# EAGLE design AIS_Mk2 (EAGLE 5.10)
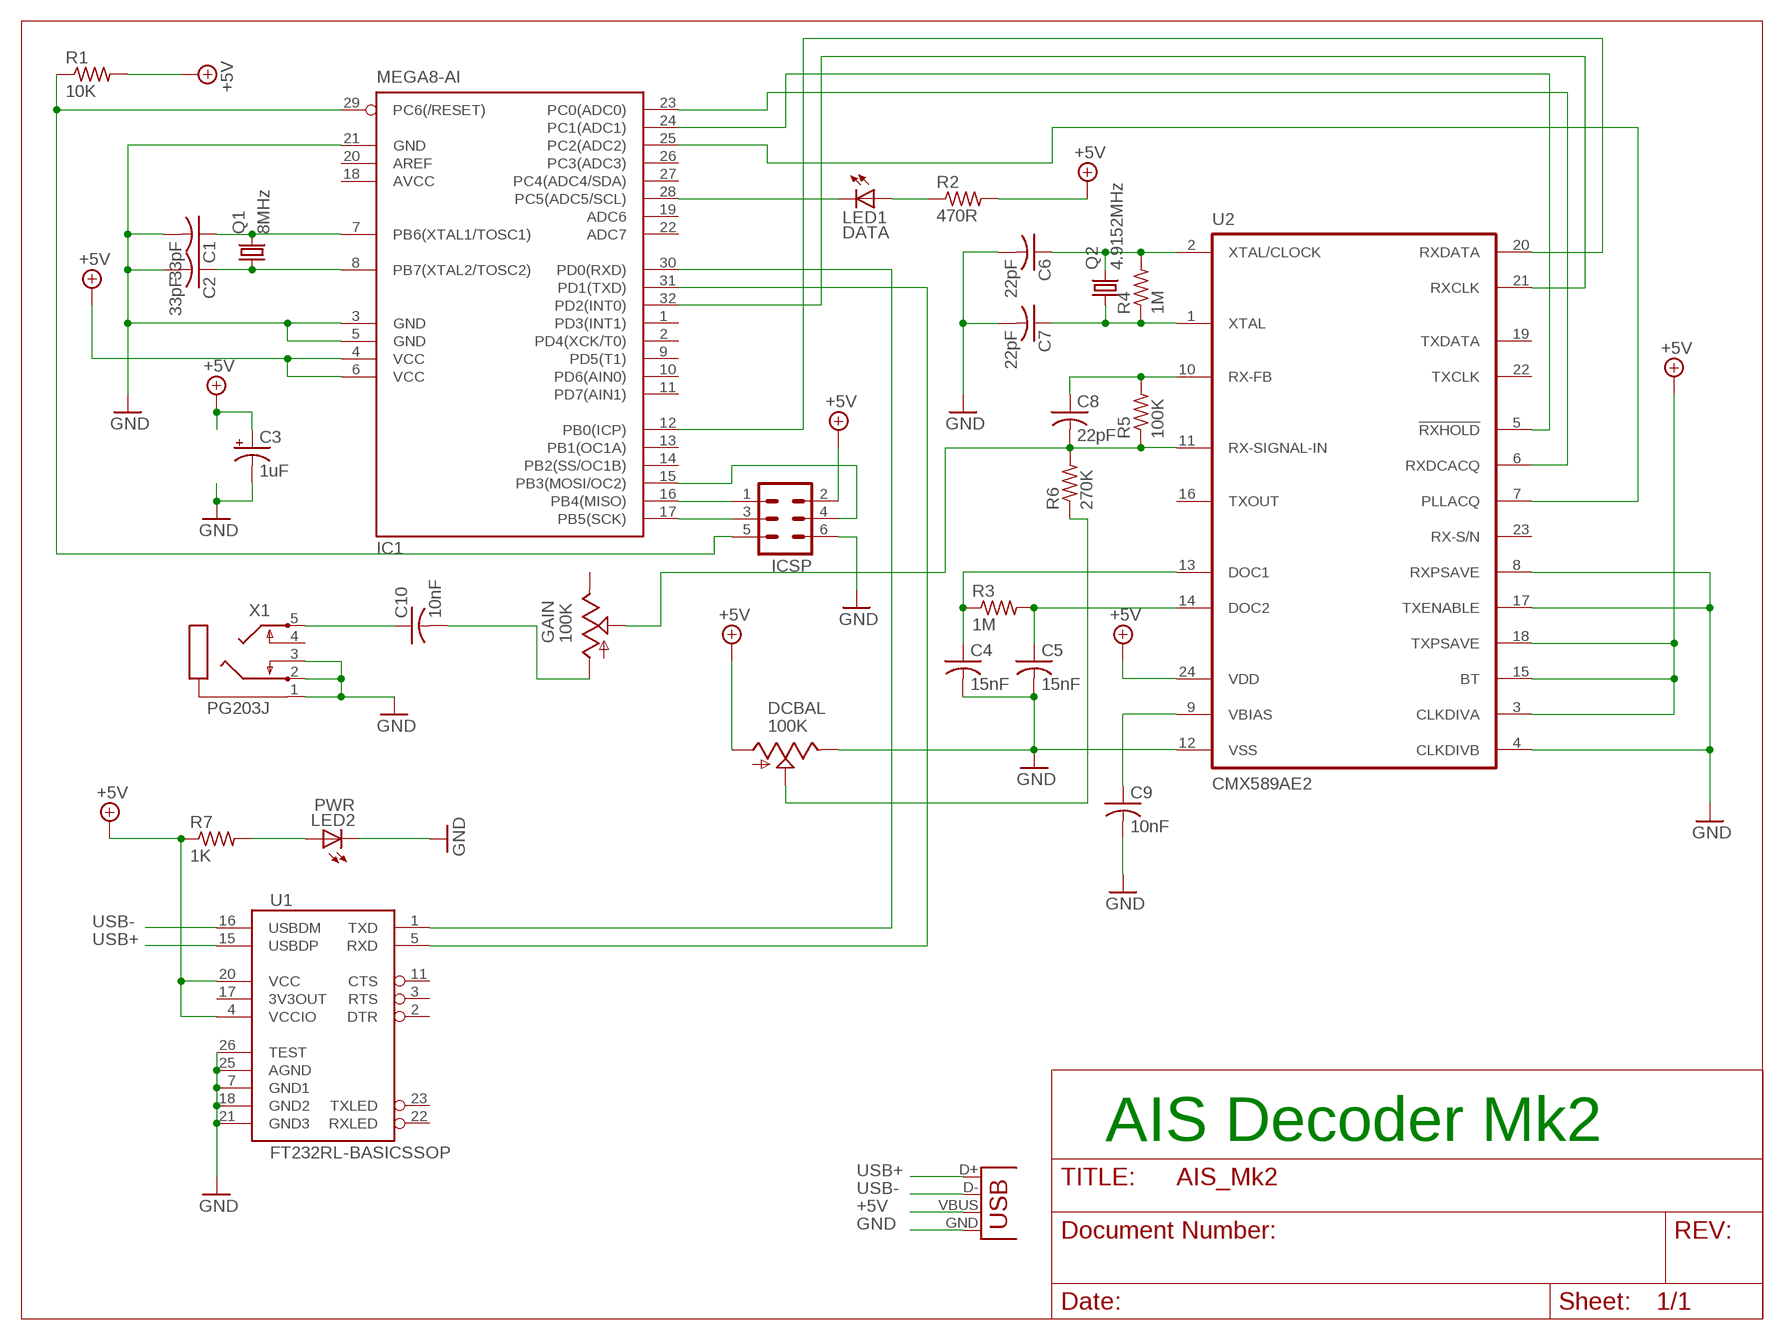
[diagram p0: schematic, sheet 1]

## Parts
C1  33pF  C-USC0805  [C0805]
C2  33pF  C-USC0805  [C0805]
C3  1uF  CPOL-USE2,5-6E  [E2,5-6E]
C4  15nF  C-USC0805  [C0805]
C5  15nF  C-USC0805  [C0805]
C6  22pF  C-USC0805  [C0805]
C7  22pF  C-USC0805  [C0805]
C8  22pF  C-USC0805  [C0805]
C9  10nF  C-USC0805  [C0805]
C10  10nF  C-USC0805  [C0805]
DCBAL  100K  TRIM_US-CA6V  [CA6V]
GAIN  100K  TRIM_US-CA6V  [CA6V]
IC1  MEGA8-AI  [TQFP32-08]
ICSP  MA03-2  [MA03-2]
LED1  DATA  LEDCHIP-LED0805  [CHIP-LED0805]
LED2  PWR  LEDCHIP-LED0805  [CHIP-LED0805]
Q1  8MHz  CRYSTALHC49S  [HC49/S]
Q2  4.9152MHz  CRYSTALHC49S  [HC49/S]
R1  10K  R-US_M0805  [M0805]
R2  470R  R-US_M0805  [M0805]
R3  1M  R-US_M0805  [M0805]
R4  1M  R-US_M0805  [M0805]
R5  100K  R-US_M0805  [M0805]
R6  270K  R-US_M0805  [M0805]
R7  1K  R-US_M0805  [M0805]
U1  FT232RL-BASICSSOP  [SSOP28DB]
U2  CMX589AE2  [TSSOP24]
X1  PG203J  [PG203J]
X2  USBSMD  [USB-MINIB]

## Nets
+5V: C3.+ DCBAL.A IC1.4(VCC) IC1.6(VCC) ICSP.2 R1.2 R2.2 R7.1 U1.4(VCCIO) U1.20(VCC) U2.3(CLKDIVA) U2.15(BT) U2.18(TXPSAVE) U2.24(VDD) X2.VBUS
DCBAL: DCBAL.S R6.1
GND: C1.2 C2.2 C3.- C4.2 C5.2 C6.2 C7.2 C9.2 DCBAL.E IC1.3(GND) IC1.5(GND) IC1.21(GND) ICSP.6 LED2.C U1.7(GND1) U1.18(GND2) U1.21(GND3) U1.25(AGND) U1.26(TEST) U2.4(CLKDIVB) U2.8(RXPSAVE) U2.12(VSS) U2.17(TXENABLE) X1.1 X1.2 X1.3 X2.GND
N$1: C2.1 IC1.8(PB7(XTAL2/TOSC2)) Q1.1
N$2: C1.1 IC1.7(PB6(XTAL1/TOSC1)) Q1.2
N$3: IC1.16(PB4(MISO)) ICSP.1
N$4: IC1.17(PB5(SCK)) ICSP.3
N$5: IC1.15(PB3(MOSI/OC2)) ICSP.4
N$6: IC1.29(PC6(/RESET)) ICSP.5 R1.1
N$7: C4.1 R3.1 U2.13(DOC1)
N$8: IC1.28(PC5(ADC5/SCL)) LED1.C
N$9: LED1.A R2.1
N$10: C5.1 R3.2 U2.14(DOC2)
N$11: IC1.30(PD0(RXD)) U1.1(TXD)
N$12: IC1.31(PD1(TXD)) U1.5(RXD)
N$13: C7.1 Q2.1 R4.1 U2.1(XTAL)
N$14: C6.1 Q2.2 R4.2 U2.2(XTAL/CLOCK)
N$15: C8.1 R5.2 U2.10(RX-FB)
N$16: C10.2 GAIN.A
N$17: C10.1 X1.5
N$18: C9.1 U2.9(VBIAS)
N$19: IC1.32(PD2(INT0)) U2.21(RXCLK)
N$20: IC1.12(PB0(ICP)) U2.20(RXDATA)
N$21: IC1.24(PC1(ADC1)) U2.5(!RXHOLD!)
N$22: IC1.23(PC0(ADC0)) U2.6(RXDCACQ)
N$23: IC1.25(PC2(ADC2)) U2.7(PLLACQ)
N$24: LED2.A R7.2
SIG: C8.2 GAIN.S R5.1 R6.2 U2.11(RX-SIGNAL-IN)
USB+: U1.15(USBDP) X2.D+
USB-: U1.16(USBDM) X2.D-
Unconnected: GAIN.E IC1.1(PD3(INT1)) IC1.2(PD4(XCK/T0)) IC1.9(PD5(T1)) IC1.10(PD6(AIN0)) IC1.11(PD7(AIN1)) IC1.13(PB1(OC1A)) IC1.14(PB2(SS/OC1B)) IC1.19(ADC6) IC1.20(AREF) IC1.22(ADC7) IC1.26(PC3(ADC3)) IC1.27(PC4(ADC4/SDA)) U1.2(DTR) U1.3(RTS) U1.11(CTS) U1.17(3V3OUT) U1.22(RXLED) U1.23(TXLED) U2.16(TXOUT) U2.19(TXDATA) U2.22(TXCLK) U2.23(RX-S/N) X1.4

## Notes on the sheet
- AIS Decoder Mk2

## Power pins joined to a net without a drawn wire
AVCC: IC1.18(AVCC)

## Library data of the parts
C1 C2 C4-C10 = resistor:C-US: CAPACITOR, American symbol
C3 = resistor:CPOL-US: POLARIZED CAPACITOR, American symbol
DCBAL GAIN = pot:TRIM_US-: POTENTIOMETER
IC1 = atmel:MEGA8: MICROCONTROLLER 8 Kbytes FLASH, 1 kbytes SRAM, 512 bytes EEPROM, USART, 6-channel 10 bit ADC, 2-channel 8 bit ADC Pin compatible with Atmega48, ATMega88, ATMega168 Source: avr.lbr
ICSP = con-lstb:MA03-2: PIN HEADER
LED1 LED2 = led:LED: LED OSRAM: - CHIPLED LG R971, LG N971, LY N971, LG Q971, LY Q971, LO R971, LY R971 LH N974, LH R974 LS Q976, LO Q976, LY Q976 LO Q996 - Hyper CHIPLED LW Q18S LB Q993, LB Q99A, LB R99A - SideLED LS A670, LO A670, LY A670, LG A670, LP A670 LB A673, LV A673, LT A673, LW A673 LH A674 LY A675 LS A676, LA A676, LO A676, LY A676, LW A676 LS A679, LY A679, LG A679 - Hyper Micro SIDELED® LS Y876, LA Y876, LO Y876, LY Y876 LT Y87S - SmartLED LW L88C, LW L88S LB L89C, LB L89S, LG L890 LS L89K, LO L89K, LY L89K LS L896, LA L896, LO L896, LY L896 - TOPLED LS T670, LO T670, LY T670, LG T670, LP T670 LSG T670, LSP T670, LSY T670, LOP T670, LYG T670 LG T671, LOG T671, LSG T671 LB T673, LV T673, LT T673, LW T673 LH T674 LS T676, LA T676, LO T676, LY T676, LB T676, LH T676, LSB T676, LW T676 LB T67C, LV T67C, LT T67C, LS T67K, LO T67K, LY T67K, LW E67C LS E67B, LA E67B, LO E67B, LY E67B, LB E67C, LV E67C, LT E67C LW T67C LS T679, LY T679, LG T679 LS T770, LO T770, LY T770, LG T770, LP T770 LB T773, LV T773, LT T773, LW T773 LH T774 LS E675, LA E675, LY E675, LS T675 LS T776, LA T776, LO T776, LY T776, LB T776 LHGB T686 LT T68C, LB T68C - Hyper Mini TOPLED® LB M676 - Mini TOPLED Santana® LG M470 LS M47K, LO M47K, LY M47K Source: http://www.osram.convergy.de LUXEON: - LUMILED® LXK2-PW12-R00, LXK2-PW12-S00, LXK2-PW14-U00, LXK2-PW14-V00 LXK2-PM12-R00, LXK2-PM12-S00, LXK2-PM14-U00 LXK2-PE12-Q00, LXK2-PE12-R00, LXK2-PE12-S00, LXK2-PE14-T00, LXK2-PE14-U00 LXK2-PB12-K00, LXK2-PB12-L00, LXK2-PB12-M00, LXK2-PB14-N00, LXK2-PB14-P00, LXK2-PB14-Q00 LXK2-PR12-L00, LXK2-PR12-M00, LXK2-PR14-Q00, LXK2-PR14-R00 LXK2-PD12-Q00, LXK2-PD12-R00, LXK2-PD12-S00 LXK2-PH12-R00, LXK2-PH12-S00 LXK2-PL12-P00, LXK2-PL12-Q00, LXK2-PL12-R00 Source: www.luxeon.com KINGBRIGHT: KA-3528ASYC Source: www.kingbright.com
Q1 Q2 = crystal:CRYSTAL: CRYSTAL
R1-R7 = resistor:R-US_: RESISTOR, American symbol
U1 = SparkFun:FT232RL-BASIC: USB UART This is the simplified version of the FT232RL unit. Only what you need, nothing you don't. Spark Fun Electronics SKU : COM-00650
U2 = cml-micro:CMX589A: HIGH-SPEED GMSK MODEM
X1 = con-hirschmann:PG203J: MIC/HEADPHONE JACK KS-S stereo microphone/headphone jack PG203JN (Schukat)
X2 = SparkFun:USB: USB Connectors USB-B-PTH is fully proven SKU : PRT-00139 USB-miniB is fully proven SKU : PRT-00587 USB-A-PCB is untested. USB-A-H is throughly reviewed, but untested. Spark Fun Electronics SKU : PRT-00437 USB-B-SMT is throughly reviewed, but untested. Needs silkscreen touching up. USB-A-S has not been used/tested USB-MB-H has not been used/tested

## Board
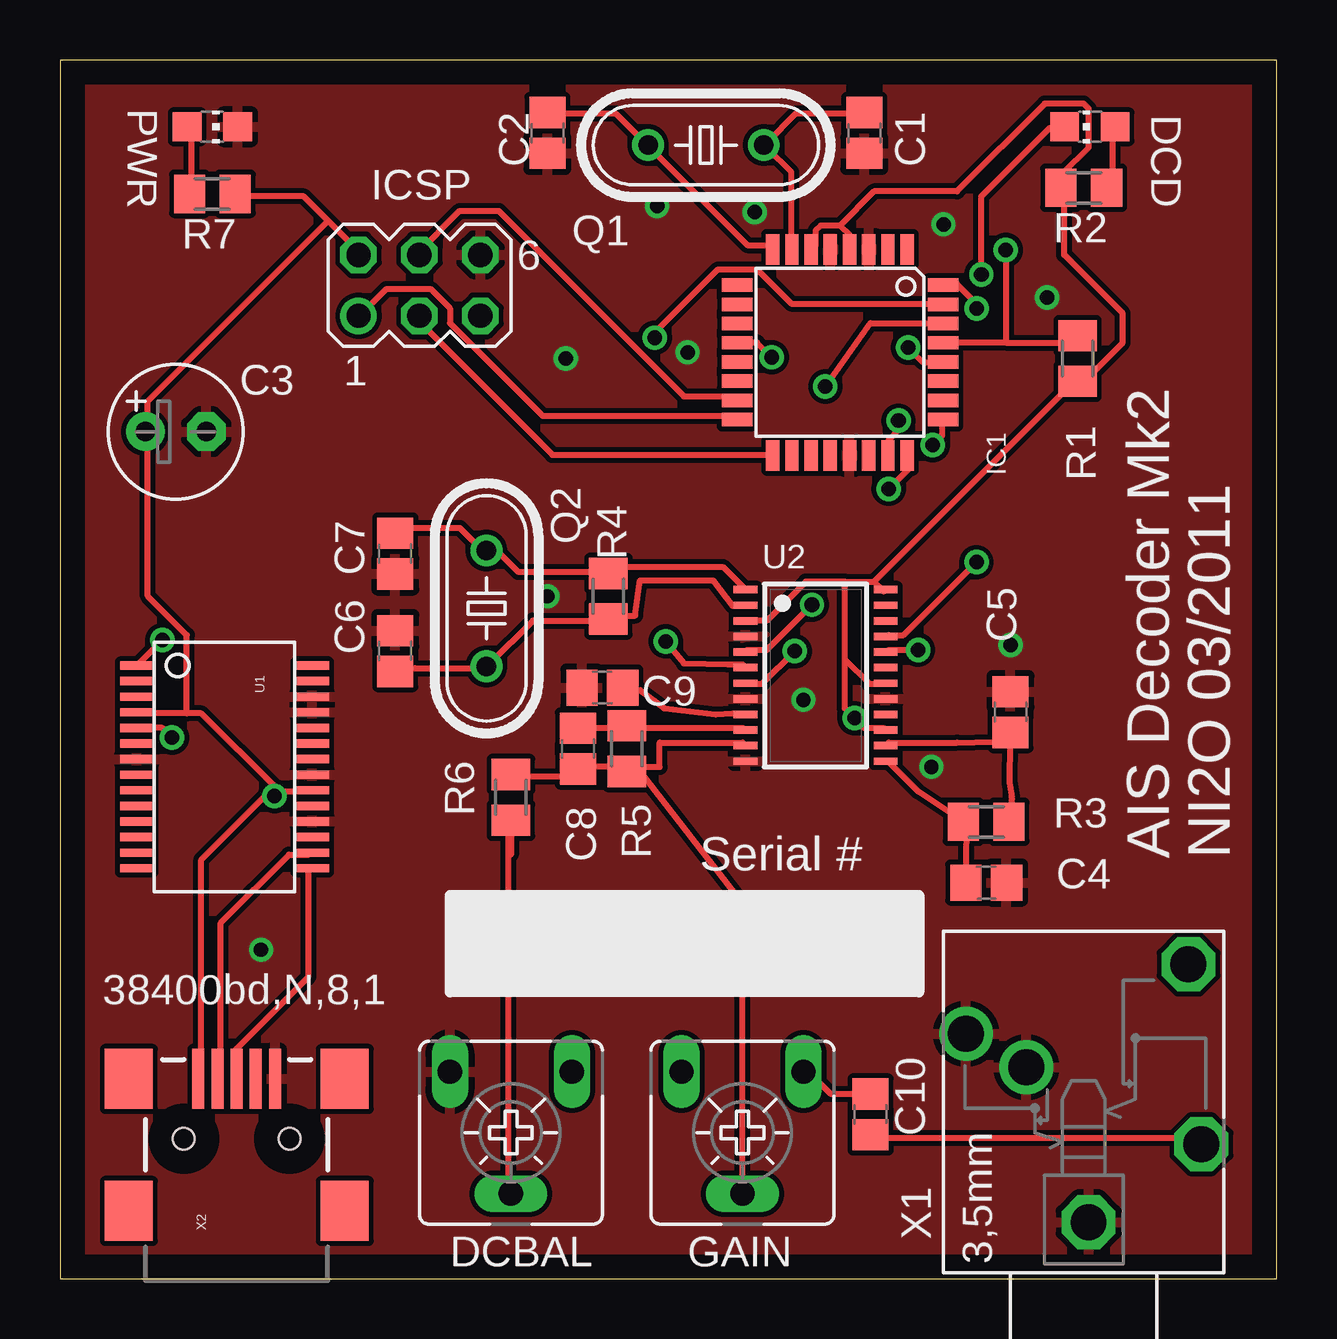
[diagram p1: board, top side]
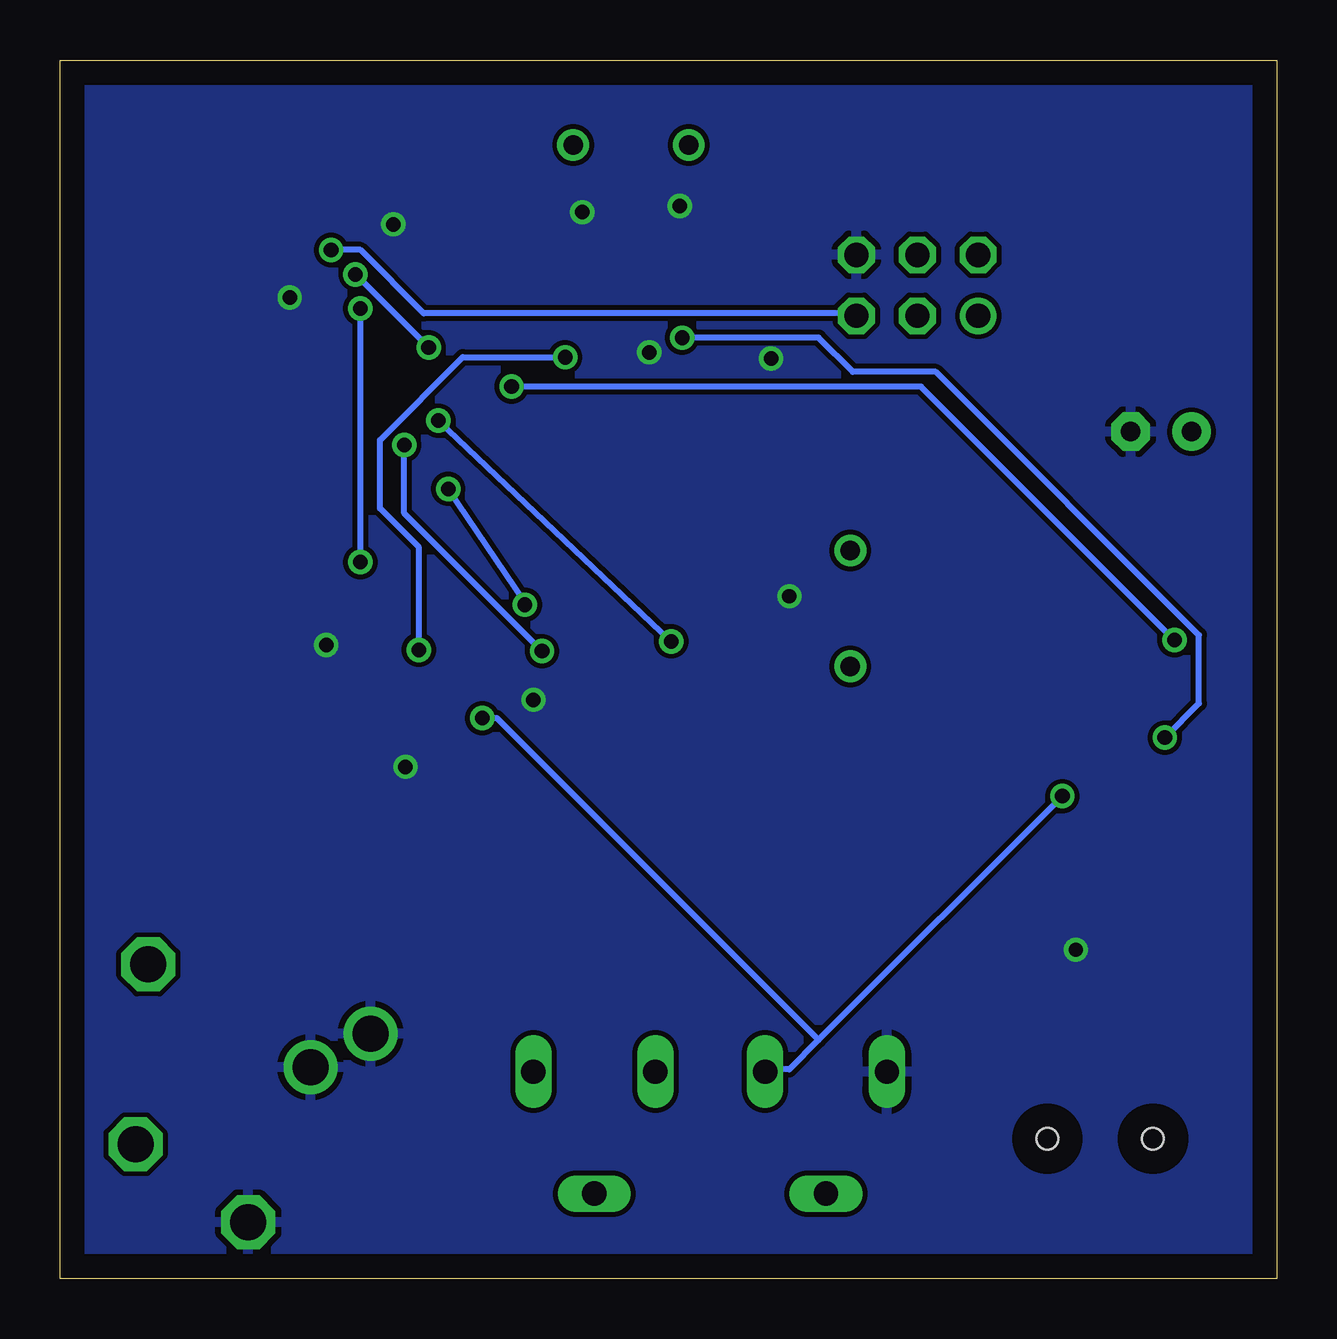
[diagram p2: board, bottom side, seen from below]

Size 50.72 x 50.79 mm. Coordinates in mm from the lower left corner, seen from the top.
Outline: 0,0 50.72,0 50.72,50.79 0,50.79 0,0
Copper layers (1*16): Top 0.035mm / dielectric 1.5mm / Bottom 0.035mm
Design rules "default": minimum track width 10mil, minimum drill 24mil, track to track 8mil, track to pad 8mil, pad to pad 8mil, via to via 8mil, smd to smd 8mil, copper to edge 40mil, drill to drill 8mil, minimum pad ring 10mil, minimum via ring 8mil, stop-mask expansion 4mil, vias tented up to drill 0mil, thermal gap 10mil

### Footprints (pad centres in the part's own frame; a part is rotated, then mirrored left to right if it is on the bottom)
C0805 = smd 1.3 x 1.5: 1 -0.85,0; 2 0.85,0
E2,5-6 = drill 0.813 pad 1.6 round: + -1.27,0 | drill 0.813 pad 1.6 octagon: - 1.27,0
CA6V = drill 1.016 long: A -2.54,-2.54; E 2.54,-2.54; S 0,2.54
TQFP32-08 = smd 1.27 x 0.559: 1 -4.293,2.8; 2 -4.293,2; 3 -4.293,1.2; 4 -4.293,0.4; 5 -4.293,-0.4; 6 -4.293,-1.2; 7 -4.293,-2; 8 -4.293,-2.8; 17 4.293,-2.8; 18 4.293,-2; 19 4.293,-1.2; 20 4.293,-0.4; 21 4.293,0.4; 22 4.293,1.2; 23 4.293,2; 24 4.293,2.8 | smd 0.559 x 1.27: 9 -2.8,-4.293; 10 -2,-4.293; 11 -1.2,-4.293; 12 -0.4,-4.293; 13 0.4,-4.293; 14 1.2,-4.293; 15 2,-4.293; 16 2.8,-4.293; 25 2.8,4.293; 26 2,4.293; 27 1.2,4.293; 28 0.4,4.293; 29 -0.4,4.293; 30 -1.2,4.293; 31 -2,4.293; 32 -2.8,4.293
MA03-2 = drill 1.016 round: 1 -2.54,-1.27 | drill 1.016 octagon: 2 -2.54,1.27; 3 0,-1.27; 4 0,1.27; 5 2.54,-1.27; 6 2.54,1.27
CHIP-LED0805 = smd 1.2 x 1.2: A 0,-1.05; C 0,1.05
HC49/S = drill 0.813 round: 1 -2.413,0; 2 2.413,0
M0805 = smd 1.3 x 1.6: 1 -0.95,0; 2 0.95,0
SSOP28DB = smd 0.348 x 1.397: 1 -4.225,-3.656; 2 -3.575,-3.656; 3 -2.925,-3.656; 4 -2.275,-3.656; 5 -1.625,-3.656; 6 -0.975,-3.656; 7 -0.325,-3.656; 8 0.325,-3.656; 9 0.975,-3.656; 10 1.625,-3.656; 11 2.275,-3.656; 12 2.925,-3.656; 13 3.575,-3.656; 14 4.225,-3.656; 15 4.225,3.656; 16 3.575,3.656; 17 2.925,3.656; 18 2.275,3.656; 19 1.625,3.656; 20 0.975,3.656; 21 0.325,3.656; 22 -0.325,3.656; 23 -0.975,3.656; 24 -1.625,3.656; 25 -2.275,3.656; 26 -2.925,3.656; 27 -3.575,3.656; 28 -4.225,3.656
TSSOP24 = smd 0.305 x 0.991: 1 -3.575,-2.918; 2 -2.925,-2.918; 3 -2.275,-2.918; 4 -1.625,-2.918; 5 -0.975,-2.918; 6 -0.325,-2.918; 7 0.325,-2.918; 8 0.975,-2.918; 9 1.625,-2.918; 10 2.275,-2.918; 11 2.925,-2.918; 12 3.575,-2.918; 13 3.575,2.918; 14 2.925,2.918; 15 2.275,2.918; 16 1.625,2.918; 17 0.975,2.918; 18 0.325,2.918; 19 -0.325,2.918; 20 -0.975,2.918; 21 -1.625,2.918; 22 -2.275,2.918; 23 -2.925,2.918; 24 -3.575,2.918
PG203J = drill 1.499 octagon: 1 -5.004,-0.203; 4 5.74,-4.369; 5 -1.753,-4.902 | drill 1.499 round: 2 2.845,4.902; 3 1.448,2.388
USB-MINIB = smd 2.5 x 0.5: D+ 2.5,0; D- 2.5,0.8; GND 2.5,-1.6; ID 2.5,-0.8; VBUS 2.5,1.6 | smd 2.5 x 2: GND@1 -3,-4.5; GND@2 -3,4.5; GND@3 2.5,4.5; GND@4 2.5,-4.5 | hole 0.9: 0,2.2; 0,-2.2

### Placement (x,y rotation side)
C1  33.53,47.75 270 top
C2  20.32,47.75 270 top
C3  1uF  [E2,5-6]  4.83,35.31 0 top
C4  38.61,16.51 0 top
C5  39.62,23.62 90 top
C6  13.97,26.16 90 top
C7  13.97,30.23 270 top
C8  21.59,22.1 270 top
C9  22.61,24.64 180 top
C10  33.78,6.86 90 top
DCBAL  18.8,6.1 180 top
GAIN  28.45,6.1 180 top
IC1  32.51,38.61 270 top
ICSP  14.99,41.4 0 top
LED1  42.93,48.01 90 top
LED2  6.35,48.01 270 top
Q1  26.92,47.24 0 top
Q2  17.78,27.94 270 top
R1  42.42,38.35 270 top
R2  42.67,45.47 180 top
R3  38.61,19.05 0 top
R4  22.86,28.45 270 top
R5  23.62,22.1 90 top
R6  18.8,20.07 90 top
R7  6.35,45.21 180 top
U1  6.86,21.34 270 top
U2  31.5,25.15 270 top
X1  42.67,7.37 90 top
X2  7.37,5.84 90 top

### Tracks (layer width: path | path; a pad name or v marks a point on that pad's centre or on a via)
+5V  (via drill 0.61)
  Top 0.254: 32.51,43.89 31.7,43.89 31.5,43.69 31.5,43.08 IC1.6 | 32.51,43.89 32.92,43.48 32.92,43.08 IC1.4 | 32.72,29.06 33.93,29.06 | 32.72,29.06 31.09,29.06 29.46,27.43 28.65,27.43 U2.3 | 33.93,29.06 34.34,28.65 U2.24 | 32.72,25.81 32.72,29.06 | 32.72,25.81 32.72,23.77 v33.12,23.37 33.53,22.96 34.34,22.96 U2.15 | 32.72,25.81 33.73,24.79 34.34,24.79 U2.18 | 33.93,29.06 42.27,37.39 R1.2 42.47,37.59 42.88,37.59 44.3,39.01 44.3,40.23 41.86,42.67 41.86,45.31 R2.2 41.86,45.52 41.86,46.13 42.88,47.14 42.88,48.77 42.67,48.97 41.05,48.97 37.39,45.31 33.93,45.31 32.51,43.89 | 11.18,44.09 12.6,42.67 ICSP.2 | 11.18,44.09 10.16,45.11 7.32,45.11 R7.1 | 11.18,44.09 3.66,36.58 3.66,35.36 C3.+ 3.66,35.15 3.66,28.45 5.28,26.82 5.28,23.57 | 5.28,23.57 5.89,23.57 8.94,20.52 | 5.28,23.57 3.25,23.57 U1.4 | 8.94,20.52 9.14,20.32 10.36,20.32 U1.20 | 8.74,20.32 8.94,20.52 | 8.74,20.32 5.89,17.48 5.89,8.53 X2.VBUS | 8.74,20.32 v8.94,20.12
  Bottom 0.254: v8.94,20.12 19.1,9.96 | 19.1,9.96 20.32,8.74 21.34,8.74 DCBAL.A | v33.12,23.37 32.51,23.37 19.1,9.96
DCBAL
  Top 0.254: 18.8,19.1 18.69,18.69 18.69,3.66 DCBAL.S | 18.8,19.1 18.8,17.68 | 18.8,19.1 R6.1
GND  (via drill 0.6)
  other vias: 21.08,38.35 26.16,38.61 41.15,40.89 20.32,28.45 8.38,13.72 36.83,43.94 30.99,24.13 36.32,21.34 39.62,26.42 24.89,44.7 28.96,44.45
  pour Bottom: 0,0 0,50.8 50.8,50.8 50.8,0
  pour Top: 0,0 0,50.8 50.8,50.8 50.8,0
N$1
  Top 0.254: C2.1 20.32,48.56 23.16,48.56 24.38,47.35 Q1.1 24.59,47.14 28.65,43.08 29.67,43.08 IC1.8
N$2
  Top 0.254: C1.1 33.53,48.56 30.68,48.56 29.46,47.35 Q1.2 29.46,47.14 30.48,46.13 30.48,43.08 IC1.7
N$3
  Top 0.254: IC1.16 28.04,35.97 20.12,35.97 16.26,39.83 16.26,40.44 15.44,41.25 13.61,41.25 12.6,40.23 ICSP.1
N$4
  Top 0.254: IC1.17 29.67,34.34 20.52,34.34 14.83,40.03 ICSP.3
N$5
  Top 0.254: IC1.15 28.04,36.78 26.01,36.78 18.29,44.5 16.66,44.5 14.83,42.67 ICSP.4
N$6  (via drill 0.61)
  Top 0.254: 39.42,39.01 42.06,39.01 42.27,39.22 R1.1 | 39.42,39.01 36.98,39.01 IC1.29 | v39.42,42.88 39.42,39.01
  Bottom 0.254: v39.42,42.88 38.2,42.88 35.56,40.23 17.68,40.23 ICSP.5
N$7
  Top 0.254: U2.13 34.54,21.54 35.76,20.32 R3.1 37.8,18.8 37.8,18.69 C4.1
N$8  (via drill 0.61)
  Top 0.254: v38.41,41.86 38.41,45.11 41.25,47.95 41.86,47.95 LED1.C | v35.36,38.81 35.97,38.2 36.78,38.2 IC1.28
  Bottom 0.254: v35.36,38.81 v38.41,41.86
N$9
  Top 0.254: LED1.A 43.89,47.95 43.89,45.72 43.69,45.52 R2.1
N$10
  Top 0.254: U2.14 34.54,22.35 37.39,22.35 39.62,22.4 C5.1 39.57,21.13 39.57,20.68 39.67,20.07 R3.2
N$11  (via drill 0.61)
  Top 0.254: v31.9,37.19 33.78,39.83 36.78,39.83 IC1.30 | v4.27,26.62 3.25,25.6 U1.1
  Bottom 0.254: v31.9,37.19 14.83,37.19 v4.27,26.62
N$12  (via drill 0.61)
  Top 0.254: v24.79,39.22 24.79,39.42 27.43,42.06 29.06,42.06 30.48,40.64 36.78,40.64 IC1.31 | v4.67,22.55 4.27,22.96 3.25,22.96 U1.5
  Bottom 0.254: v24.79,39.22 19.1,39.22 17.68,37.8 14.22,37.8 3.25,26.82 3.25,23.98 v4.67,22.55
N$13
  Top 0.254: U2.1 28.45,28.85 27.64,29.67 23.16,29.67 22.96,29.46 R4.1 22.76,29.46 19.1,29.46 18.29,30.28 17.88,30.28 Q2.1 17.68,30.28 16.66,31.29 14.02,31.29 C7.1
N$14
  Top 0.254: U2.2 28.45,28.04 28.04,28.04 27.23,29.11 24.18,29.11 23.98,27.64 22.96,27.64 R4.2 22.76,27.43 19.71,27.43 17.88,25.6 Q2.2 17.68,25.6 17.58,25.45 14.78,25.45 C6.1
N$15
  Top 0.254: U2.10 28.45,22.96 23.98,22.96 R5.2 23.77,22.96 21.95,22.96 C8.1
N$16
  Top 0.254: C10.2 33.73,7.72 32.11,7.72 31.09,8.74 GAIN.A
N$17
  Top 0.254: C10.1 33.93,5.89 47.35,5.89 47.55,5.69 X1.5
N$18
  Top 0.254: U2.9 28.45,23.57 28.04,23.57 27.33,23.52 25.2,23.77 24.18,24.54 C9.1
N$19  (via drill 0.61)
  Top 0.254: v38.2,29.87 35.15,26.82 34.54,26.82 U2.21 | v38.2,40.44 38.2,40.64 37.39,41.45 36.98,41.45 IC1.32
  Bottom 0.254: v38.2,29.87 v38.2,40.44
N$20  (via drill 0.61)
  Top 0.254: v35.76,26.21 34.54,26.21 U2.20 | v29.67,38.41 29.06,39.01 28.25,39.01 IC1.12
  Bottom 0.254: v35.76,26.21 35.76,30.48 37.39,32.11 37.39,34.95 33.93,38.41 v29.67,38.41
N$21  (via drill 0.61)
  Top 0.254: v31.34,28.09 29.46,26.21 28.65,26.21 U2.5 | v34.54,32.92 35.36,33.73 35.36,34.14 IC1.24
  Bottom 0.254: v31.34,28.09 31.34,28.19 v34.54,32.92
N$22  (via drill 0.61)
  Top 0.254: v25.25,26.57 26.01,25.65 27.84,25.6 28.45,25.6 U2.6 | v34.95,35.76 34.95,35.36 34.54,34.95 34.54,34.34 IC1.23
  Bottom 0.254: v25.25,26.57 v34.95,35.76
N$23  (via drill 0.61)
  Top 0.254: v30.63,26.16 29.26,24.79 28.65,24.79 U2.7 | v36.37,34.75 36.78,35.15 36.78,35.76 IC1.25
  Bottom 0.254: v30.63,26.16 36.37,31.9 v36.37,34.75
N$24
  Top 0.254: LED2.A 5.49,47.95 5.49,45.31 R7.2
SIG
  Top 0.254: 24.03,21.34 23.98,21.34 | 24.03,21.34 24.99,21.34 24.99,22.35 28.45,22.35 U2.11 | 23.98,21.34 R5.1 23.77,21.34 | 23.98,21.34 23.77,21.34 | 23.77,21.34 21.95,21.34 C8.2 21.74,21.13 21.54,20.93 19.1,20.93 R6.2 | 24.03,21.34 28.45,15.65 GAIN.S
USB+
  Top 0.254: U1.15 10.36,17.07 10.36,12.6 7.32,9.55 7.32,8.53 X2.D+
USB-
  Top 0.254: U1.16 10.36,17.68 9.55,17.68 6.71,14.83 6.71,8.53 X2.D-

### Text on the board
tPlace: PWR | DCD | ICSP | AIS Decoder Mk2 | NI2O 03/2011 | Serial # | 38400bd,N,8,1 | DCBAL | GAIN